# EAGLE design Angelo Dual Filter MAIN v1 (EAGLE 7.7.0)
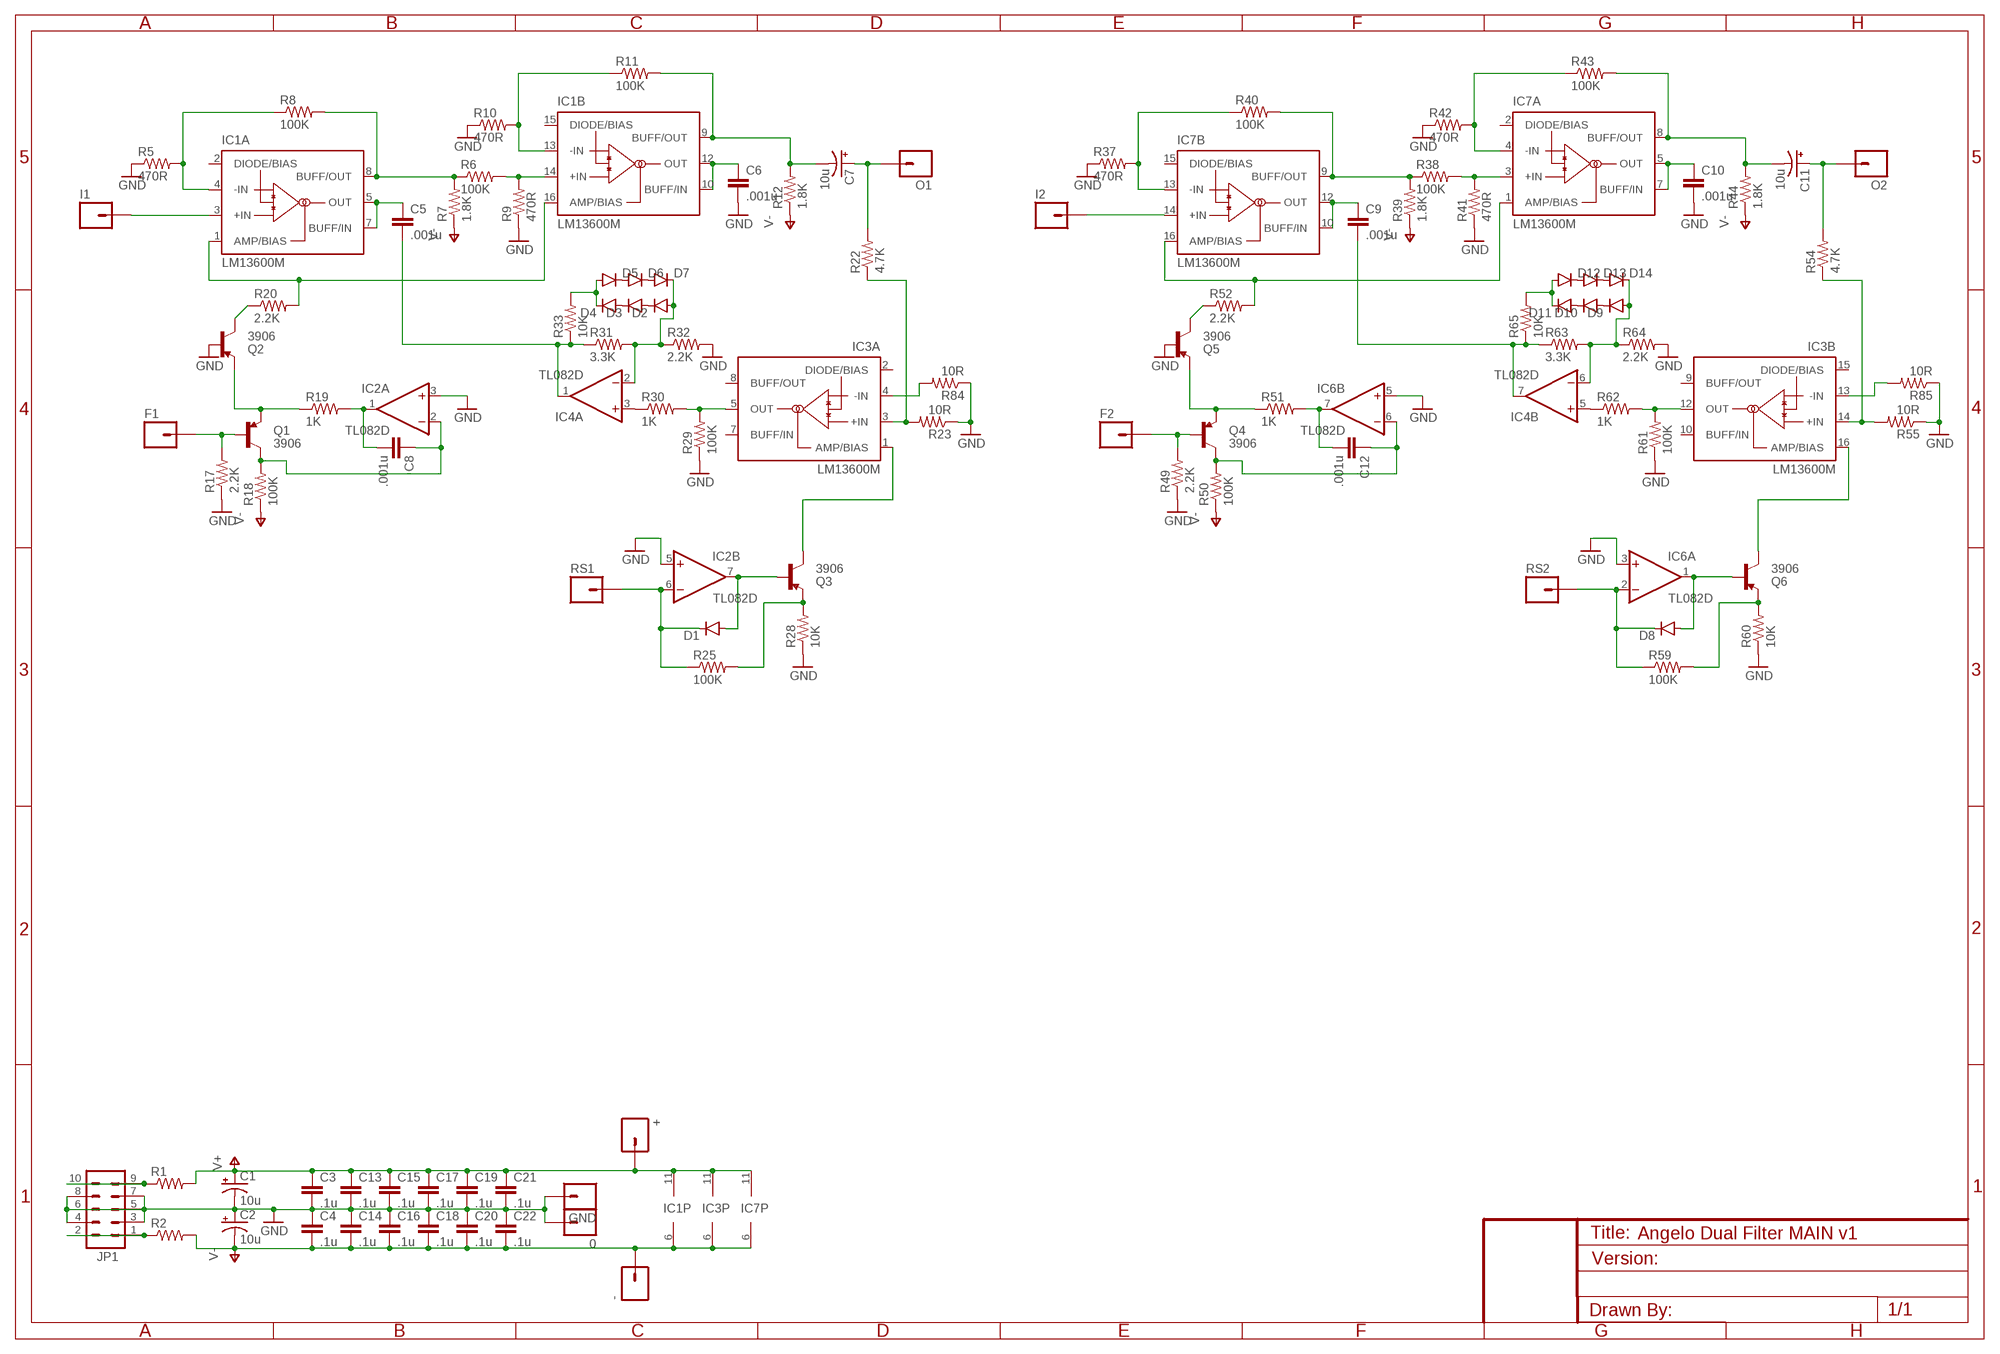
[diagram p0: schematic, sheet 1]

## Parts
0  M01PTH  [1X01]
+  M01PTH  [1X01]
-  M01PTH  [1X01]
C1  10u  CAP_POLPTH2  [CPOL-RADIAL-10UF-25V]
C2  10u  CAP_POLPTH2  [CPOL-RADIAL-10UF-25V]
C3  .1u  CAP0805  [0805]
C4  .1u  CAP0805  [0805]
C5  .001u  C5/2.5  [C5B2.5]
C6  .001u  C5/2.5  [C5B2.5]
C7  10u  CAP_POLPTH2  [CPOL-RADIAL-10UF-25V]
C8  .001u  CAP0805  [0805]
C9  .001u  C5/2.5  [C5B2.5]
C10  .001u  C5/2.5  [C5B2.5]
C11  10u  CAP_POLPTH2  [CPOL-RADIAL-10UF-25V]
C12  .001u  CAP0805  [0805]
C13  .1u  CAP0805  [0805]
C14  .1u  CAP0805  [0805]
C15  .1u  CAP0805  [0805]
C16  .1u  CAP0805  [0805]
C17  .1u  CAP0805  [0805]
C18  .1u  CAP0805  [0805]
C19  .1u  CAP0805  [0805]
C20  .1u  CAP0805  [0805]
C21  .1u  CAP0805  [0805]
C22  .1u  CAP0805  [0805]
D1  DIODESOD123  [SOD-123]
D2  DIODESOD123  [SOD-123]
D3  DIODESOD123  [SOD-123]
D4  DIODESOD123  [SOD-123]
D5  DIODESOD123  [SOD-123]
D6  DIODESOD123  [SOD-123]
D7  DIODESOD123  [SOD-123]
D8  DIODESOD123  [SOD-123]
D9  DIODESOD123  [SOD-123]
D10  DIODESOD123  [SOD-123]
D11  DIODESOD123  [SOD-123]
D12  DIODESOD123  [SOD-123]
D13  DIODESOD123  [SOD-123]
D14  DIODESOD123  [SOD-123]
F1  M01PTH  [1X01]
F2  M01PTH  [1X01]
GND  M01PTH  [1X01]
I1  M01PTH  [1X01]
I2  M01PTH  [1X01]
IC1  LM13600M  [SO16]
IC2  TL082D  [SO08]
IC3  LM13600M  [SO16]
IC4  TL082D  [SO08]
IC6  TL082D  [SO08]
IC7  LM13600M  [SO16]
JP1  M05X2PTH  [AVR_ICSP]
O1  M01PTH  [1X01]
O2  M01PTH  [1X01]
Q1  3906  TRANSISTOR_PNPPMBT3906  [SOT23-3]
Q2  3906  TRANSISTOR_PNPPMBT3906  [SOT23-3]
Q3  3906  TRANSISTOR_PNPPMBT3906  [SOT23-3]
Q4  3906  TRANSISTOR_PNPPMBT3906  [SOT23-3]
Q5  3906  TRANSISTOR_PNPPMBT3906  [SOT23-3]
Q6  3906  TRANSISTOR_PNPPMBT3906  [SOT23-3]
R1  RESISTOR0805-RES  [0805]
R2  RESISTOR0805-RES  [0805]
R5  470R  RESISTOR0805-RES  [0805]
R6  100K  RESISTOR0805-RES  [0805]
R7  1.8K  RESISTOR0805-RES  [0805]
R8  100K  RESISTOR0805-RES  [0805]
R9  470R  RESISTOR0805-RES  [0805]
R10  470R  RESISTOR0805-RES  [0805]
R11  100K  RESISTOR0805-RES  [0805]
R12  1.8K  RESISTOR0805-RES  [0805]
R17  2.2K  RESISTOR0805-RES  [0805]
R18  100K  RESISTOR0805-RES  [0805]
R19  1K  RESISTOR0805-RES  [0805]
R20  2.2K  RESISTOR0805-RES  [0805]
R22  4.7K  RESISTOR0805-RES  [0805]
R23  10R  RESISTOR0805-RES  [0805]
R25  100K  RESISTOR0805-RES  [0805]
R28  10K  RESISTOR0805-RES  [0805]
R29  100K  RESISTOR0805-RES  [0805]
R30  1K  RESISTOR0805-RES  [0805]
R31  3.3K  RESISTOR0805-RES  [0805]
R32  2.2K  RESISTOR0805-RES  [0805]
R33  10K  RESISTOR0805-RES  [0805]
R37  470R  RESISTOR0805-RES  [0805]
R38  100K  RESISTOR0805-RES  [0805]
R39  1.8K  RESISTOR0805-RES  [0805]
R40  100K  RESISTOR0805-RES  [0805]
R41  470R  RESISTOR0805-RES  [0805]
R42  470R  RESISTOR0805-RES  [0805]
R43  100K  RESISTOR0805-RES  [0805]
R44  1.8K  RESISTOR0805-RES  [0805]
R49  2.2K  RESISTOR0805-RES  [0805]
R50  100K  RESISTOR0805-RES  [0805]
R51  1K  RESISTOR0805-RES  [0805]
R52  2.2K  RESISTOR0805-RES  [0805]
R54  4.7K  RESISTOR0805-RES  [0805]
R55  10R  RESISTOR0805-RES  [0805]
R59  100K  RESISTOR0805-RES  [0805]
R60  10K  RESISTOR0805-RES  [0805]
R61  100K  RESISTOR0805-RES  [0805]
R62  1K  RESISTOR0805-RES  [0805]
R63  3.3K  RESISTOR0805-RES  [0805]
R64  2.2K  RESISTOR0805-RES  [0805]
R65  10K  RESISTOR0805-RES  [0805]
R84  10R  RESISTOR0805-RES  [0805]
R85  10R  RESISTOR0805-RES  [0805]
RS1  M01PTH  [1X01]
RS2  M01PTH  [1X01]

## Nets
GND: 0.1 C1.2(-) C2.1(+) C3.2 C4.1 C6.2 C10.2 C13.2 C14.1 C15.2 C16.1 C17.2 C18.1 C19.2 C20.1 C21.2 C22.1 GND.1 IC2.3(A:+IN) IC2.5(B:+IN) IC6.3(A:+IN) IC6.5(B:+IN) JP1.3 JP1.4 JP1.5 JP1.6 JP1.7 JP1.8 Q2.1(B) Q5.1(B) R5.1 R9.1 R10.1 R17.1 R23.1 R28.1 R29.1 R32.2 R37.1 R41.1 R42.1 R49.1 R55.1 R60.1 R61.1 R64.2 R84.1 R85.1
N$1: JP1.9 JP1.10 R1.1
N$2: JP1.1 JP1.2 R2.1
N$3: I1.1 IC1.3(A:+IN)
N$4: I2.1 IC7.14(B:+IN)
N$5: IC1.4(A:-IN) R5.2 R8.1
N$6: C5.1 IC1.5(A:OUT) IC1.7(A:BUFF/IN)
N$7: C6.1 IC1.10(B:BUFF/IN) IC1.12(B:OUT)
N$8: IC1.8(A:BUFF/OUT) R6.1 R7.2 R8.2
N$9: IC1.14(B:+IN) R6.2 R9.2
N$10: IC1.13(B:-IN) R10.2 R11.1
N$11: C7.2(-) IC1.9(B:BUFF/OUT) R11.2 R12.2
N$18: C8.1 IC2.2(A:-IN) Q1.3(C) R18.2
N$19: C8.2 IC2.1(A:OUT) R19.2
N$20: Q1.2(E) Q2.2(E) R19.1
N$21: Q2.3(C) R20.1
N$22: IC1.1(A:AMP/BIAS) IC1.16(B:AMP/BIAS) R20.2
N$24: IC3.3(A:+IN) R22.1 R23.2
N$25: C7.1(+) O1.1 R22.2
N$28: D1.C IC2.6(B:-IN) R25.1 RS1.1
N$32: D1.A IC2.7(B:OUT) Q3.1(B)
N$33: Q3.2(E) R25.2 R28.2
N$34: IC3.1(A:AMP/BIAS) Q3.3(C)
N$35: IC3.5(A:OUT) R29.2 R30.2
N$36: IC4.3(A:+IN) R30.1
N$37: D2.A D7.C IC4.2(A:-IN) R31.2 R32.1
N$38: D2.C D3.A
N$39: D3.C D4.A
N$40: D5.C D6.A
N$41: D6.C D7.A
N$42: D4.C D5.A R33.2
N$43: C5.2 IC4.1(A:OUT) R31.1 R33.1
N$46: IC7.13(B:-IN) R37.2 R40.1
N$47: C9.1 IC7.10(B:BUFF/IN) IC7.12(B:OUT)
N$48: IC7.9(B:BUFF/OUT) R38.1 R39.2 R40.2
N$49: IC7.3(A:+IN) R38.2 R41.2
N$50: IC7.4(A:-IN) R42.2 R43.1
N$51: C11.2(-) IC7.8(A:BUFF/OUT) R43.2 R44.2
N$52: C10.1 IC7.5(A:OUT) IC7.7(A:BUFF/IN)
N$58: C12.1 IC6.6(B:-IN) Q4.3(C) R50.2
N$59: C12.2 IC6.7(B:OUT) R51.2
N$60: Q4.2(E) Q5.2(E) R51.1
N$61: IC7.1(A:AMP/BIAS) IC7.16(B:AMP/BIAS) R52.2
N$62: F2.1 Q4.1(B) R49.2
N$63: C11.1(+) O2.1 R54.2
N$65: IC3.14(B:+IN) R54.1 R55.2
N$70: D8.C IC6.2(A:-IN) R59.1 RS2.1
N$71: Q5.3(C) R52.1
N$72: D8.A IC6.1(A:OUT) Q6.1(B)
N$73: Q6.2(E) R59.2 R60.2
N$74: IC3.16(B:AMP/BIAS) Q6.3(C)
N$75: IC3.12(B:OUT) R61.2 R62.2
N$76: IC4.5(B:+IN) R62.1
N$77: D9.A D14.C IC4.6(B:-IN) R63.2 R64.1
N$78: D9.C D10.A
N$79: D10.C D11.A
N$80: D12.C D13.A
N$81: D13.C D14.A
N$82: D11.C D12.A R65.2
N$83: C9.2 IC4.7(B:OUT) R63.1 R65.1
N$85: IC3.4(A:-IN) R84.2
N$86: IC3.13(B:-IN) R85.2
N$90: F1.1 Q1.1(B) R17.2
V+: +.1 C1.1(+) C3.1 C13.1 C15.1 C17.1 C19.1 C21.1 IC1.11(P:V+) IC3.11(P:V+) IC7.11(P:V+) R1.2
V-: -.1 C2.2(-) C4.2 C14.2 C16.2 C18.2 C20.2 C22.2 IC1.6(P:V-) IC3.6(P:V-) IC7.6(P:V-) R2.2 R7.1 R12.1 R18.1 R39.1 R44.1 R50.1
Unconnected: IC1.2(A:DIODE/BIAS) IC1.15(B:DIODE/BIAS) IC3.2(A:DIODE/BIAS) IC3.7(A:BUFF/IN) IC3.8(A:BUFF/OUT) IC3.9(B:BUFF/OUT) IC3.10(B:BUFF/IN) IC3.15(B:DIODE/BIAS) IC7.2(A:DIODE/BIAS) IC7.15(B:DIODE/BIAS)

## Power pins joined to a net without a drawn wire
V+: IC2.8(P:V+) IC4.8(P:V+) IC6.8(P:V+)
V-: IC2.4(P:V-) IC4.4(P:V-) IC6.4(P:V-)

## Library data of the parts
0 + - F1 F2 GND I1 I2 O1 O2 RS1 RS2 = SparkFun-Connectors:M01: Header 1 Standard 1-pin 0.1" header. Use with straight break away headers (SKU : PRT-00116), right angle break away headers (PRT-00553), swiss pins (PRT-00743), machine pins (PRT-00117), and female headers (PRT-00115).
C1 C2 C7 C11 = SparkFun-Capacitors:CAP_POL: Capacitor Polarized These are standard SMD and PTH capacitors. Normally 10uF, 47uF, and 100uF in electrolytic and tantalum varieties. Always verify the external diameter of the through hole cap, it varies with capacity, voltage, and manufacturer. The EIA devices should be standard.
C3 C4 C8 C12-C22 = SparkFun-Passives:CAP: Capacitor Standard 0603 ceramic capacitor, and 0.1" leaded capacitor.
C5 C6 C9 C10 = capacitor-wima:C: CAPACITOR naming: grid - package width
D1-D14 = SparkFun-DiscreteSemi:DIODE: Diode These are standard reverse protection diodes and small signal diodes. SMA package can handle up to about 1A. SOD-323 can handle about 200mA. What the SOD-323 package when ordering, there are some mfgs out there that are 5-pin packages.
IC1 IC3 IC7 = national-semiconductor:LM13600: Dual Operational Transconductance Amplifiers with Linearizing Diodes and Buffers Source: lm13600.PDF
IC2 IC4 IC6 = linear:TL082: OP AMP Data sheet <http://www.ti.com/lit/ds/symlink/tl084a . pdf>; DATA_SHEET: <a href="http://www.ti.com/lit/ds/symlink/tl084a.pdf"> Data sheet </a>
JP1 = SparkFun-Connectors:M05X2: Header 5x2 Standard 10-pin dual row 0.1" header. Commonly used with AVR-ISP. Use with Spark Fun Electronics SKU: PRT-00778
Q1-Q6 = SparkFun-DiscreteSemi:TRANSISTOR_PNP: Generic PNP BJT Double check pinouts against datasheets- not all devices are the same! MMBT3906 - 40V 200mA SOT-23 (TRANS-08052) MMBT4403 - 40V 600mA SOT-23 (TRANS-09245); PROD_ID: TRANS-08052; VALUE: PMBT3906
R1 R2 R5-R12 R17-R20 R22 R23 R25 R28-R33 R37-R44 R49-R52 R54 R55 R59-R65 R84 R85 = SparkFun-Passives:RESISTOR: Resistor Basic schematic elements and footprints for 0603, 1206, and PTH resistors.

## Board
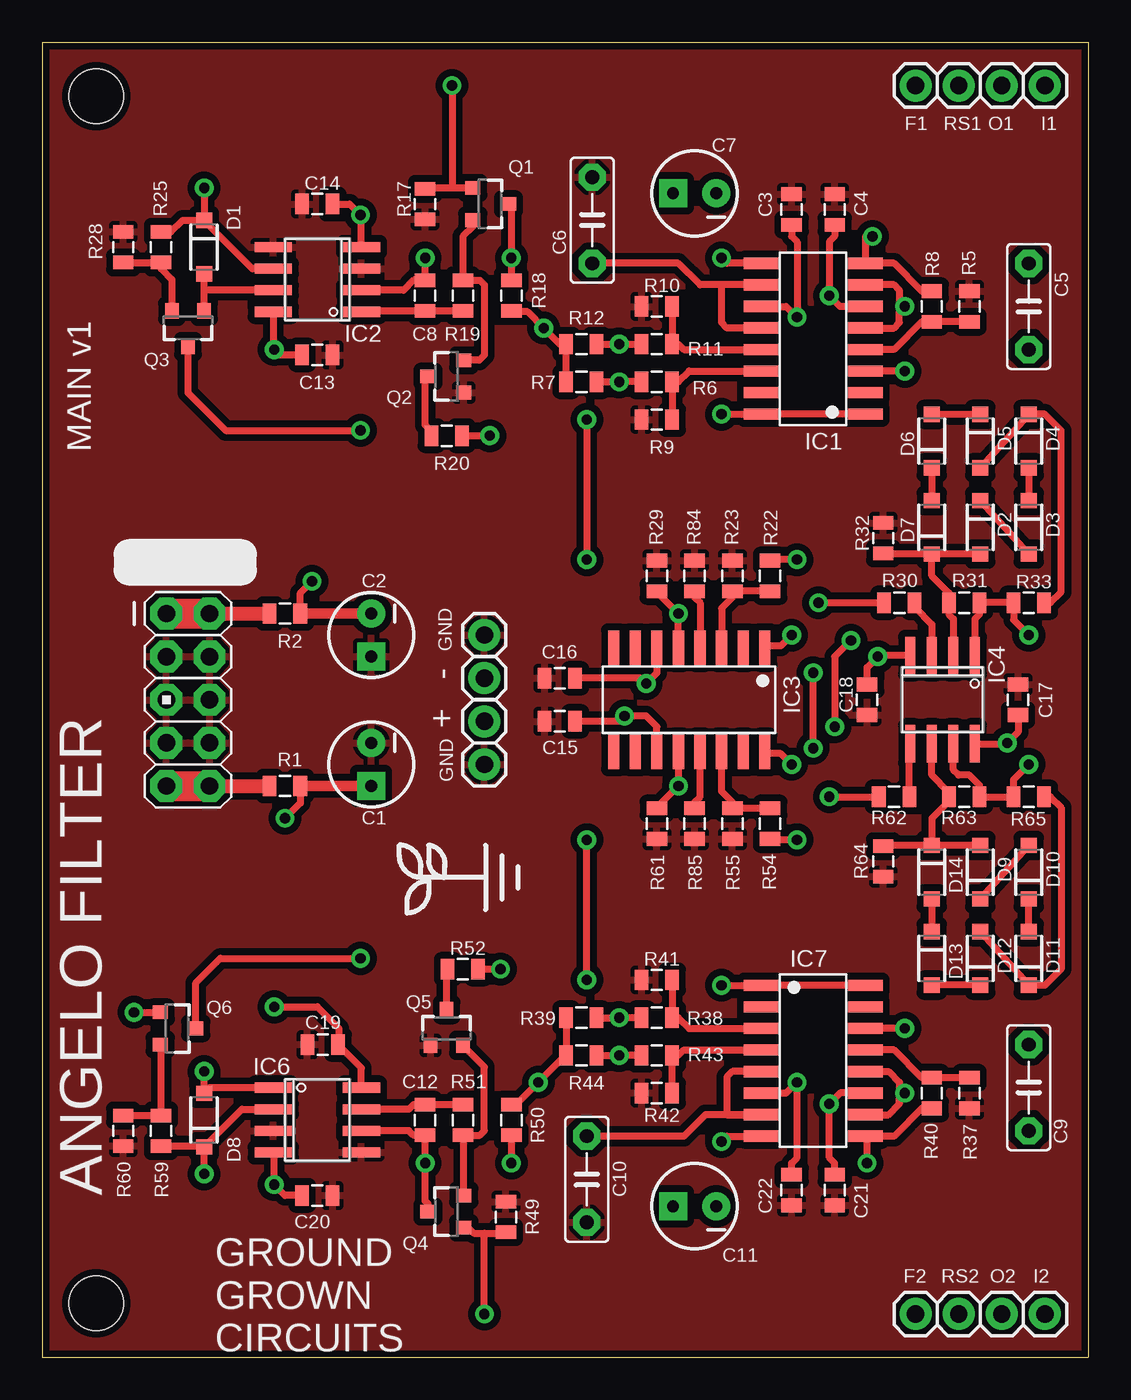
[diagram p1: board, top side]
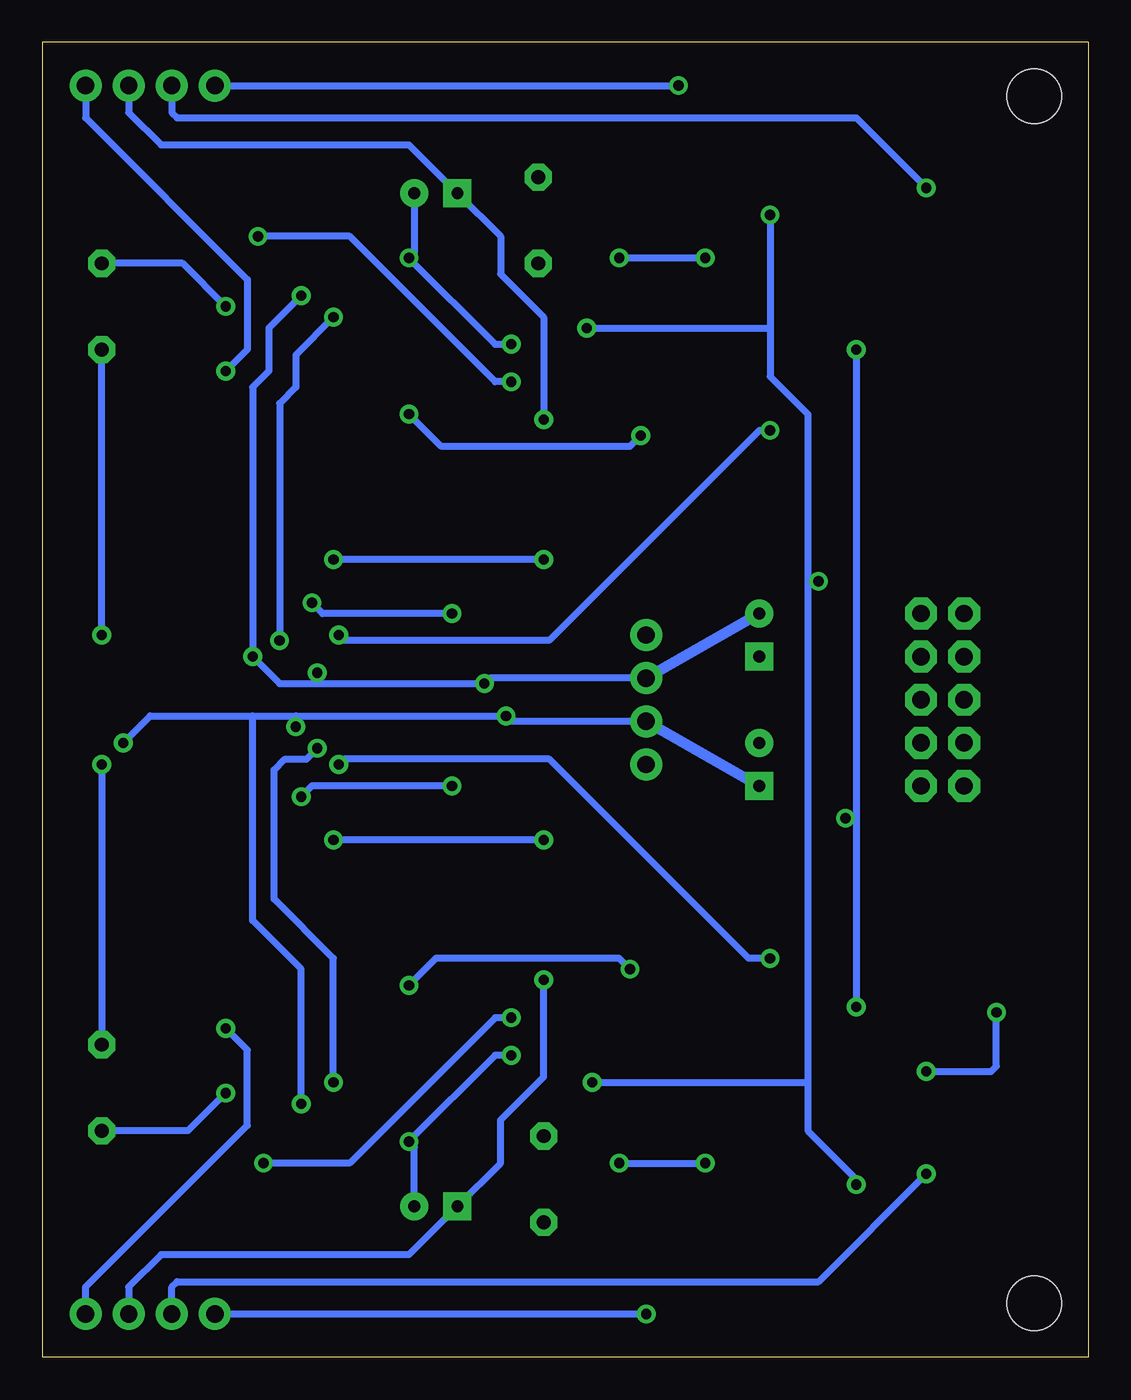
[diagram p2: board, bottom side, seen from below]

Size 61.59 x 77.47 mm. Coordinates in mm from the lower left corner, seen from the top.
Outline: 0,0 61.59,0 61.59,77.47 0,77.47 0,0
Copper layers (1*16): Top 0.035mm / dielectric 1.5mm / Bottom 0.035mm
Design rules "SparkFun": minimum track width 8mil, minimum drill 20mil, track to track 8mil, track to pad 8mil, pad to pad 8mil, via to via 8mil, smd to smd 8mil, copper to edge 8mil, drill to drill 8mil, minimum pad ring 12mil, minimum via ring 10mil, stop-mask expansion 4mil, vias tented up to drill 20mil, thermal gap 10mil
Holes 3.2 mm at 3.17,74.3 3.17,3.17

### Footprints (pad centres in the part's own frame; a part is rotated, then mirrored left to right if it is on the bottom)
1X01 = drill 1.016 pad 1.88: 1 0,0
CPOL-RADIAL-10UF-25V = drill 0.7 pad 1.651 square: 1 1.27,0 | drill 0.7 pad 1.651: 2 -1.27,0
0805 = smd 0.8 x 1.2: 1 -0.9,0; 2 0.9,0
C5B2.5 = drill 0.813 pad 1.6 octagon: 1 -2.54,0; 2 2.54,0
SOD-123 = smd 0.9 x 0.95: A 1.575,0; C -1.575,0
SO16 = smd 0.66 x 2.032: 1 -4.445,-3.073; 2 -3.175,-3.073; 3 -1.905,-3.073; 4 -0.635,-3.073; 5 0.635,-3.073; 6 1.905,-3.073; 7 3.175,-3.073; 8 4.445,-3.073; 9 4.445,3.073; 10 3.175,3.073; 11 1.905,3.073; 12 0.635,3.073; 13 -0.635,3.073; 14 -1.905,3.073; 15 -3.175,3.073; 16 -4.445,3.073
SO08 = smd 0.6 x 2.2: 1 -1.905,-2.6; 2 -0.635,-2.6; 3 0.635,-2.6; 4 1.905,-2.6; 5 1.905,2.6; 6 0.635,2.6; 7 -0.635,2.6; 8 -1.905,2.6
AVR_ICSP = drill 1.016 pad 1.88 octagon: 1 -1.27,5.08; 2 1.27,5.08; 3 -1.27,2.54; 4 1.27,2.54; 5 -1.27,0; 6 1.27,0; 7 -1.27,-2.54; 8 1.27,-2.54; 9 -1.27,-5.08; 10 1.27,-5.08
SOT23-3 = smd 0.8 x 0.9: 1 -0.95,-1; 2 0.95,-1; 3 0,1.1

### Placement (x,y rotation side)
0  26.04,42.55 90 top
+  26.04,37.47 90 top
-  26.04,40.01 90 top
C1  19.37,34.92 270 top
C2  19.37,42.55 270 top
C3  44.13,67.63 90 top
C4  46.67,67.63 270 top
C5  58.1,61.91 270 top
C6  32.38,66.99 90 top
C7  38.42,68.58 180 top
C8  22.54,62.55 270 top
C9  58.1,15.88 90 top
C10  32.07,10.48 270 top
C11  38.42,8.89 180 top
C12  22.54,13.97 90 top
C13  16.19,59.05 0 top
C14  16.19,67.94 0 top
C15  30.48,37.47 180 top
C16  30.48,40.01 0 top
C17  57.47,38.73 90 top
C18  48.58,38.73 90 top
C19  16.51,18.41 180 top
C20  16.19,9.53 180 top
C21  46.67,9.84 270 top
C22  44.13,9.84 90 top
D1  9.53,65.41 270 top
D2  55.24,48.9 270 top
D3  58.1,48.9 270 top
D4  58.1,53.98 270 top
D5  55.24,53.98 270 top
D6  52.39,53.98 90 top
D7  52.39,48.9 90 top
D8  9.53,13.97 90 top
D9  55.24,28.57 90 top
D10  58.1,28.57 90 top
D11  58.1,23.5 90 top
D12  55.24,23.5 90 top
D13  52.39,23.5 270 top
D14  52.39,28.57 270 top
F1  51.44,74.93 180 top
F2  51.44,2.54 0 top
GND  26.04,34.92 90 top
I1  59.05,74.93 180 top
I2  59.05,2.54 0 top
IC1  45.4,60.01 90 top
IC2  16.19,63.5 90 top
IC3  38.1,38.73 180 top
IC4  53.02,38.73 180 top
IC6  16.19,13.97 270 top
IC7  45.4,17.46 270 top
JP1  8.57,38.73 0 top
O1  56.52,74.93 180 top
O2  56.52,2.54 0 top
Q1  26.35,67.94 270 top
Q2  23.81,57.78 90 top
Q3  8.57,60.64 180 top
Q4  23.81,8.57 90 top
Q5  23.81,19.37 0 top
Q6  7.94,19.37 270 top
R1  14.29,33.66 0 top
R2  14.29,43.81 0 top
R5  54.61,61.91 270 top
R6  36.2,57.47 0 top
R7  31.75,57.47 0 top
R8  52.39,61.91 90 top
R9  36.2,55.24 0 top
R10  36.2,61.91 0 top
R11  36.2,59.69 180 top
R12  31.75,59.69 0 top
R17  22.54,67.94 90 top
R18  27.62,62.55 90 top
R19  24.77,62.55 270 top
R20  23.81,54.29 0 top
R22  42.86,46.04 90 top
R23  40.64,46.04 270 top
R25  6.99,65.41 270 top
R28  4.76,65.41 270 top
R29  36.2,46.04 270 top
R30  50.48,44.45 180 top
R31  54.29,44.45 180 top
R32  49.53,48.26 90 top
R33  58.1,44.45 0 top
R37  54.61,15.56 90 top
R38  36.2,20 0 top
R39  31.75,20 0 top
R40  52.39,15.56 270 top
R41  36.2,22.23 0 top
R42  36.2,15.56 0 top
R43  36.2,17.78 180 top
R44  31.75,17.78 0 top
R49  27.3,8.26 270 top
R50  27.62,13.97 270 top
R51  24.77,13.97 90 top
R52  24.77,22.86 0 top
R54  42.86,31.43 270 top
R55  40.64,31.43 90 top
R59  6.99,13.34 90 top
R60  4.76,13.34 90 top
R61  36.2,31.43 90 top
R62  50.16,33.02 180 top
R63  54.29,33.02 180 top
R64  49.53,29.21 270 top
R65  58.1,33.02 0 top
R84  38.42,46.04 270 top
R85  38.42,31.43 90 top
RS1  53.98,74.93 180 top
RS2  53.98,2.54 0 top
U$1  [LOGO_SMALL]  26.04,28.26 90 top

### Tracks (layer width: path | path; a pad name or v marks a point on that pad's centre or on a via)
GND
  pour Top (isolate 0.406): 0,0 61.59,0 61.59,77.47 0,77.47
N$1
  Top 0.813: JP1.10 R1.1
  Top 1.778: JP1.9 JP1.10
N$2
  Top 0.813: JP1.2 R2.1
  Top 1.778: JP1.1 JP1.2
N$3  (via drill 0.6)
  Top 0.406: v50.8,58.1 IC1.3
  Bottom 0.406: I1.1 59.05,73.03 49.53,63.5 49.53,59.37 v50.8,58.1
N$4  (via drill 0.6)
  Top 0.406: v50.8,19.37 IC7.14
  Bottom 0.406: I2.1 59.05,4.13 49.53,13.65 49.53,18.1 v50.8,19.37
N$5
  Top 0.406: R5.2 R8.1 51.8,61.01 50.16,59.37 IC1.4
N$6  (via drill 0.6)
  Top 0.406: IC1.5 50.16,60.64 50.48,60.96 50.48,61.59 v50.8,61.91 50.48,62.23 50.48,62.87 50.16,63.18 IC1.7
  Bottom 0.406: v50.8,61.91 53.34,64.45 C5.1
N$7
  Top 0.406: IC1.12 40.32,60.64 40.01,60.96 40.01,63.18 | IC1.10 40.01,63.18 | 40.01,63.18 38.73,63.18 37.47,64.45 C6.1
N$8  (via drill 0.6)
  Top 0.406: R8.2 51.8,62.81 50.16,64.45 IC1.8 48.48,66.04 v48.9,66.04 | R6.1 v33.97,57.47 R7.2
  Bottom 0.406: v33.97,57.47 34.92,57.47 43.5,66.04 v48.9,66.04
N$9
  Top 0.406: IC1.14 38.1,58.1 37.47,57.47 R6.2 R9.2
N$10
  Top 0.406: R10.2 R11.1 37.47,59.69 37.78,59.37 IC1.13
N$11  (via drill 0.6)
  Top 0.406: IC1.9 40.32,64.45 v40.01,64.77 | R11.2 v33.97,59.69 R12.2
  Bottom 0.406: v33.97,59.69 34.92,59.69 v40.01,64.77 39.69,65.09 C7.2
N$18  (via drill 0.6)
  Top 0.406: Q1.3 27.62,67.78 v27.62,64.77 R18.2 | IC2.2 21.27,62.87 21.86,63.45 C8.1 v22.54,64.77
  Bottom 0.406: v22.54,64.77 v27.62,64.77
N$19
  Top 0.406: R19.2 C8.2 18.84,61.65 IC2.1
N$20
  Top 0.406: Q1.2 25.35,66.63 24.77,66.04 R19.1 25.77,63.45 26.04,63.18 26.04,59.05 25.72,58.74 Q2.2
N$21
  Top 0.406: R20.1 22.91,54.56 22.54,54.93 22.54,57.62 Q2.3
N$22  (via drill 0.6)
  Top 0.406: IC1.1 IC1.16 v40.01,55.56 | R20.2 v26.35,54.29
  Bottom 0.406: v26.35,54.29 26.99,53.66 38.1,53.66 v40.01,55.56
N$24
  Top 0.406: R22.1 R23.2 40.64,44.77 40.01,44.13 IC3.3
N$25  (via drill 0.6)
  Top 0.406: v32.07,55.24 v32.07,46.99 | v44.45,46.99 42.91,46.99 R22.2
  Bottom 0.406: O1.1 56.52,73.34 54.61,71.44 40.01,71.44 C7.1 34.61,66.04 34.61,63.82 32.07,61.28 v32.07,55.24 | v32.07,46.99 v44.45,46.99
N$28  (via drill 0.6)
  Top 0.406: R25.1 7.57,66.31 8.26,66.99 9.51,66.99 D1.C | IC2.6 12.37,64.14 D1.C | v9.53,68.9 D1.C
  Bottom 0.406: RS1.1 53.98,73.34 53.66,73.03 13.65,73.03 v9.53,68.9
N$32
  Top 0.406: IC2.7 9.53,62.87 | 9.53,62.87 D1.A | Q3.1 9.52,62.86 9.53,62.87
N$33
  Top 0.406: Q3.2 7.62,63.5 6.99,64.14 R25.2 R28.2
N$34  (via drill 0.6)
  Top 0.406: Q3.3 8.57,56.83 10.79,54.61 v18.73,54.61 | v44.13,42.55 43.5,41.91 42.65,41.91 IC3.1
  Bottom 0.406: v18.73,54.61 19.37,54.61 31.75,42.23 43.81,42.23 v44.13,42.55
N$35  (via drill 0.6)
  Top 0.406: IC3.5 v37.47,43.81 36.2,45.09 R29.2 | v45.72,44.45 R30.2
  Bottom 0.406: v37.47,43.81 45.09,43.81 v45.72,44.45
N$36
  Top 0.406: R30.1 51.38,44.19 52.39,43.18 IC4.3
N$37
  Top 0.406: IC4.2 53.66,43.5 53.39,43.76 R31.2 53.39,45.03 52.39,46.04 D7.C | D2.A D7.C | D7.C 49.57,47.32 R32.1
N$38
  Top 0.406: D2.C D3.A
N$39
  Top 0.406: D4.A D3.C
N$40
  Top 0.406: D5.C D6.A
N$41
  Top 0.406: D6.C D7.A
N$42
  Top 0.406: D5.A D4.C 58.12,55.56 59.05,55.56 60.01,54.61 60.01,45.09 59.37,44.45 R33.2
N$43  (via drill 0.6)
  Top 0.406: IC4.1 54.93,43.5 55.19,43.76 R31.1 R33.1 57.2,43.45 v58.1,42.55
  Bottom 0.406: v58.1,42.55 C5.2
N$46
  Top 0.406: IC7.13 50.16,18.1 51.8,16.46 R40.1 R37.2
N$47  (via drill 0.6)
  Top 0.406: IC7.12 49.85,16.83 50.48,16.19 50.48,15.88 v50.8,15.56 50.48,15.24 50.48,14.92 49.85,14.29 IC7.10
  Bottom 0.406: v50.8,15.56 53.02,13.34 C9.1
N$48  (via drill 0.6)
  Top 0.406: R39.2 v33.97,20 R38.1 | v48.58,11.43 48.58,12.92 IC7.9 50.16,13.02 51.8,14.66 R40.2
  Bottom 0.406: v33.97,20 34.92,20 43.5,11.43 v48.58,11.43
N$49
  Top 0.406: R41.2 R38.2 37.47,20 38.1,19.37 IC7.3
N$50
  Top 0.406: R42.2 R43.1 37.47,17.78 37.78,18.1 IC7.4
N$51  (via drill 0.6)
  Top 0.406: R43.2 v33.97,17.78 R44.2 | v40.01,12.7 40.32,13.02 IC7.8
  Bottom 0.406: v33.97,17.78 34.92,17.78 v40.01,12.7 39.69,12.38 C11.2
N$52
  Top 0.406: IC7.5 40.64,16.83 40.32,16.51 40.32,14.29 IC7.7 39.05,14.29 37.78,13.02 C10.1
N$58  (via drill 0.6)
  Top 0.406: IC6.6 21.59,13.34 21.86,13.07 C12.1 v22.54,11.43 22.54,9.21 22.71,9.04 Q4.3 | R50.2 v27.62,11.43
  Bottom 0.406: v27.62,11.43 v22.54,11.43
N$59
  Top 0.406: R51.2 C12.2 21.86,14.87 21.59,14.61 IC6.7
N$60
  Top 0.406: Q4.2 24.81,13.02 R51.1 25.77,13.07 26.04,13.34 26.04,17.09 Q5.2
N$61  (via drill 0.6)
  Top 0.406: IC7.16 IC7.1 v40.01,21.91 | R52.2 v26.99,22.86
  Bottom 0.406: v26.99,22.86 27.62,23.5 38.42,23.5 v40.01,21.91
N$62  (via drill 0.6)
  Top 0.406: v26.04,2.54 26.04,7.3 | 26.04,7.3 27.25,7.3 R49.2 | Q4.1 25.08,7.62 25.4,7.3 26.04,7.3
  Bottom 0.406: F2.1 v26.04,2.54
N$63  (via drill 0.6)
  Top 0.406: v32.07,22.23 v32.07,30.48 | v44.45,30.48 42.91,30.48 R54.2
  Bottom 0.406: O2.1 56.52,4.13 54.61,6.03 40.01,6.03 C11.1 34.61,11.43 34.61,13.97 32.07,16.51 v32.07,22.23 | v32.07,30.48 v44.45,30.48
N$65
  Top 0.406: R54.1 R55.2 40.64,32.7 40.01,33.34 IC3.14
N$70  (via drill 0.6)
  Top 0.406: D8.C 11.75,14.61 IC6.2 | R59.1 9.48,12.44 D8.C | v9.53,10.79 D8.C
  Bottom 0.406: RS2.1 53.98,4.13 53.66,4.45 15.88,4.45 v9.53,10.79
N$71
  Top 0.406: Q5.3 23.81,22.81 R52.1
N$72  (via drill 0.6)
  Top 0.406: IC6.1 9.86,15.88 D8.A v9.53,16.83 | v5.4,20.32 Q6.1
  Bottom 0.406: v9.53,16.83 5.71,16.83 5.4,17.14 v5.4,20.32
N$73
  Top 0.406: R60.2 R59.2 6.99,18.37 Q6.2
N$74  (via drill 0.6)
  Top 0.406: Q6.3 9.04,22.05 10.48,23.5 v18.73,23.5 | v44.13,34.92 43.5,35.56 42.65,35.56 IC3.16
  Bottom 0.406: v18.73,23.5 20,23.5 31.75,35.24 43.81,35.24 v44.13,34.92
N$75  (via drill 0.6)
  Top 0.406: IC3.12 v37.47,33.66 36.2,32.38 R61.2 | v46.35,33.02 R62.2
  Bottom 0.406: v37.47,33.66 45.72,33.66 v46.35,33.02
N$76
  Top 0.406: R62.1 51.06,36.08 IC4.5
N$77
  Top 0.406: D9.A D14.C | D14.C 49.57,30.15 R64.1 | D14.C 52.39,31.75 53.39,32.76 R63.2 53.39,33.28 52.39,34.29 IC4.6
N$78
  Top 0.406: D9.C D10.A
N$79
  Top 0.406: D11.A D10.C
N$80
  Top 0.406: D12.C D13.A
N$81
  Top 0.406: D14.A D13.C
N$82
  Top 0.406: D12.A D11.C 58.12,21.91 59.05,21.91 60.01,22.86 60.01,32.38 59.37,33.02 R65.2
N$83  (via drill 0.6)
  Top 0.406: IC4.7 53.66,34.61 53.98,34.29 54.61,34.29 55.19,33.71 R63.1 R65.1 57.2,34.02 v58.1,34.92
  Bottom 0.406: v58.1,34.92 C9.2
N$85
  Top 0.406: R84.2 38.42,44.77 38.73,44.45 IC3.4
N$86
  Top 0.406: R85.2 38.42,32.7 38.73,33.02 IC3.13
N$90  (via drill 0.6)
  Top 0.406: Q1.1 24.13,68.89 | 24.13,68.89 22.59,68.89 R17.2 | v24.13,74.93 24.13,68.89
  Bottom 0.406: F1.1 v24.13,74.93
V+  (via drill 0.6)
  Top 0.406: IC2.8 13.59,59.43 v13.65,59.37 13.97,59.05 C13.1 | v13.65,20.64 16.19,20.64 17.46,19.37 17.46,18.47 C19.1 18.79,17.03 IC6.8 | R1.2 15.19,32.65 v14.29,31.75 | C15.1 33.97,37.47 v34.29,37.78 35.56,37.78 36.2,37.15 IC3.11 | IC4.8 56.77,36.13 v56.83,36.2 57.47,36.83 C17.1 | IC1.11 43.81,61.91 v44.45,61.28 44.45,65.72 44.13,66.04 C3.1 | v47.62,42.23 46.67,41.27 v46.67,37.15 | IC7.11 46.99,15.56 v46.35,14.92 46.35,11.75 46.67,11.43 C21.1
  Top 0.61: C1.1 R1.2
  Bottom 0.406: v13.65,59.37 13.65,31.75 | 13.65,31.75 v13.65,20.64 | v14.29,31.75 13.65,31.75 | +.1 33.97,37.47 v34.29,37.78 46.67,37.78 | v56.83,36.2 55.24,37.78 49.21,37.78 | 49.21,37.78 46.67,37.78 | v44.45,61.28 46.67,59.05 46.67,57.15 47.62,56.2 v47.62,42.23 | v46.67,37.15 46.67,37.78 | v46.35,14.92 46.35,22.86 49.21,25.72 49.21,37.78
  Bottom 0.61: C1.1 +.1
V-  (via drill 0.6)
  Top 0.406: R7.1 R12.1 30.48,59.69 v29.53,60.64 28.57,61.59 27.68,61.59 R18.1 | IC2.4 18.79,67.25 v18.73,67.31 18.1,67.94 C14.2 | IC6.4 13.65,12.01 v13.65,10.16 14.29,9.53 C20.2 | R2.2 15.19,45.03 v15.88,45.72 | C16.2 35.24,40.01 v35.56,39.69 36.2,40.32 IC3.6 | IC4.4 49.27,41.34 v49.21,41.27 48.58,40.64 C18.2 | IC1.6 46.99,61.91 v46.35,62.55 46.35,65.72 46.67,66.04 C4.2 | IC7.6 43.81,15.56 v44.45,16.19 44.45,11.75 44.13,11.43 C22.2 | v45.4,35.88 v45.4,40.32 | R39.1 R44.1 30.8,17.78 v29.21,16.19 27.89,14.87 R50.1
  Top 0.61: C2.2 R2.2
  Bottom 0.406: v18.73,67.31 18.73,60.64 | 18.73,60.64 18.73,57.78 16.51,55.56 16.51,45.72 | 16.51,45.72 16.51,16.19 | 16.51,16.19 16.51,13.34 13.65,10.48 v13.65,10.16 | v15.88,45.72 16.51,45.72 | -.1 35.24,40.01 v35.56,39.69 45.4,39.69 | 45.4,39.69 47.62,39.69 v49.21,41.27 49.21,57.15 48.26,58.1 48.26,60.64 v46.35,62.55 | v44.45,16.19 44.45,23.5 47.94,26.99 47.94,34.61 47.31,35.24 46.04,35.24 v45.4,35.88 | v45.4,40.32 45.4,39.69 | v29.53,60.64 18.73,60.64 | v29.21,16.19 16.51,16.19
  Bottom 0.61: C2.2 -.1

### Text on the board
tPlace: MAIN v1 | GND | ANGELO FILTER | GROUND / GROWN / CIRCUITS